# EAGLE design zumy_carrier_board (EAGLE 6.6.0)
AUTHOR: A.Pullin / A.J.Chen / A.D.Buchan; REVISION: F; YEAR: 2015
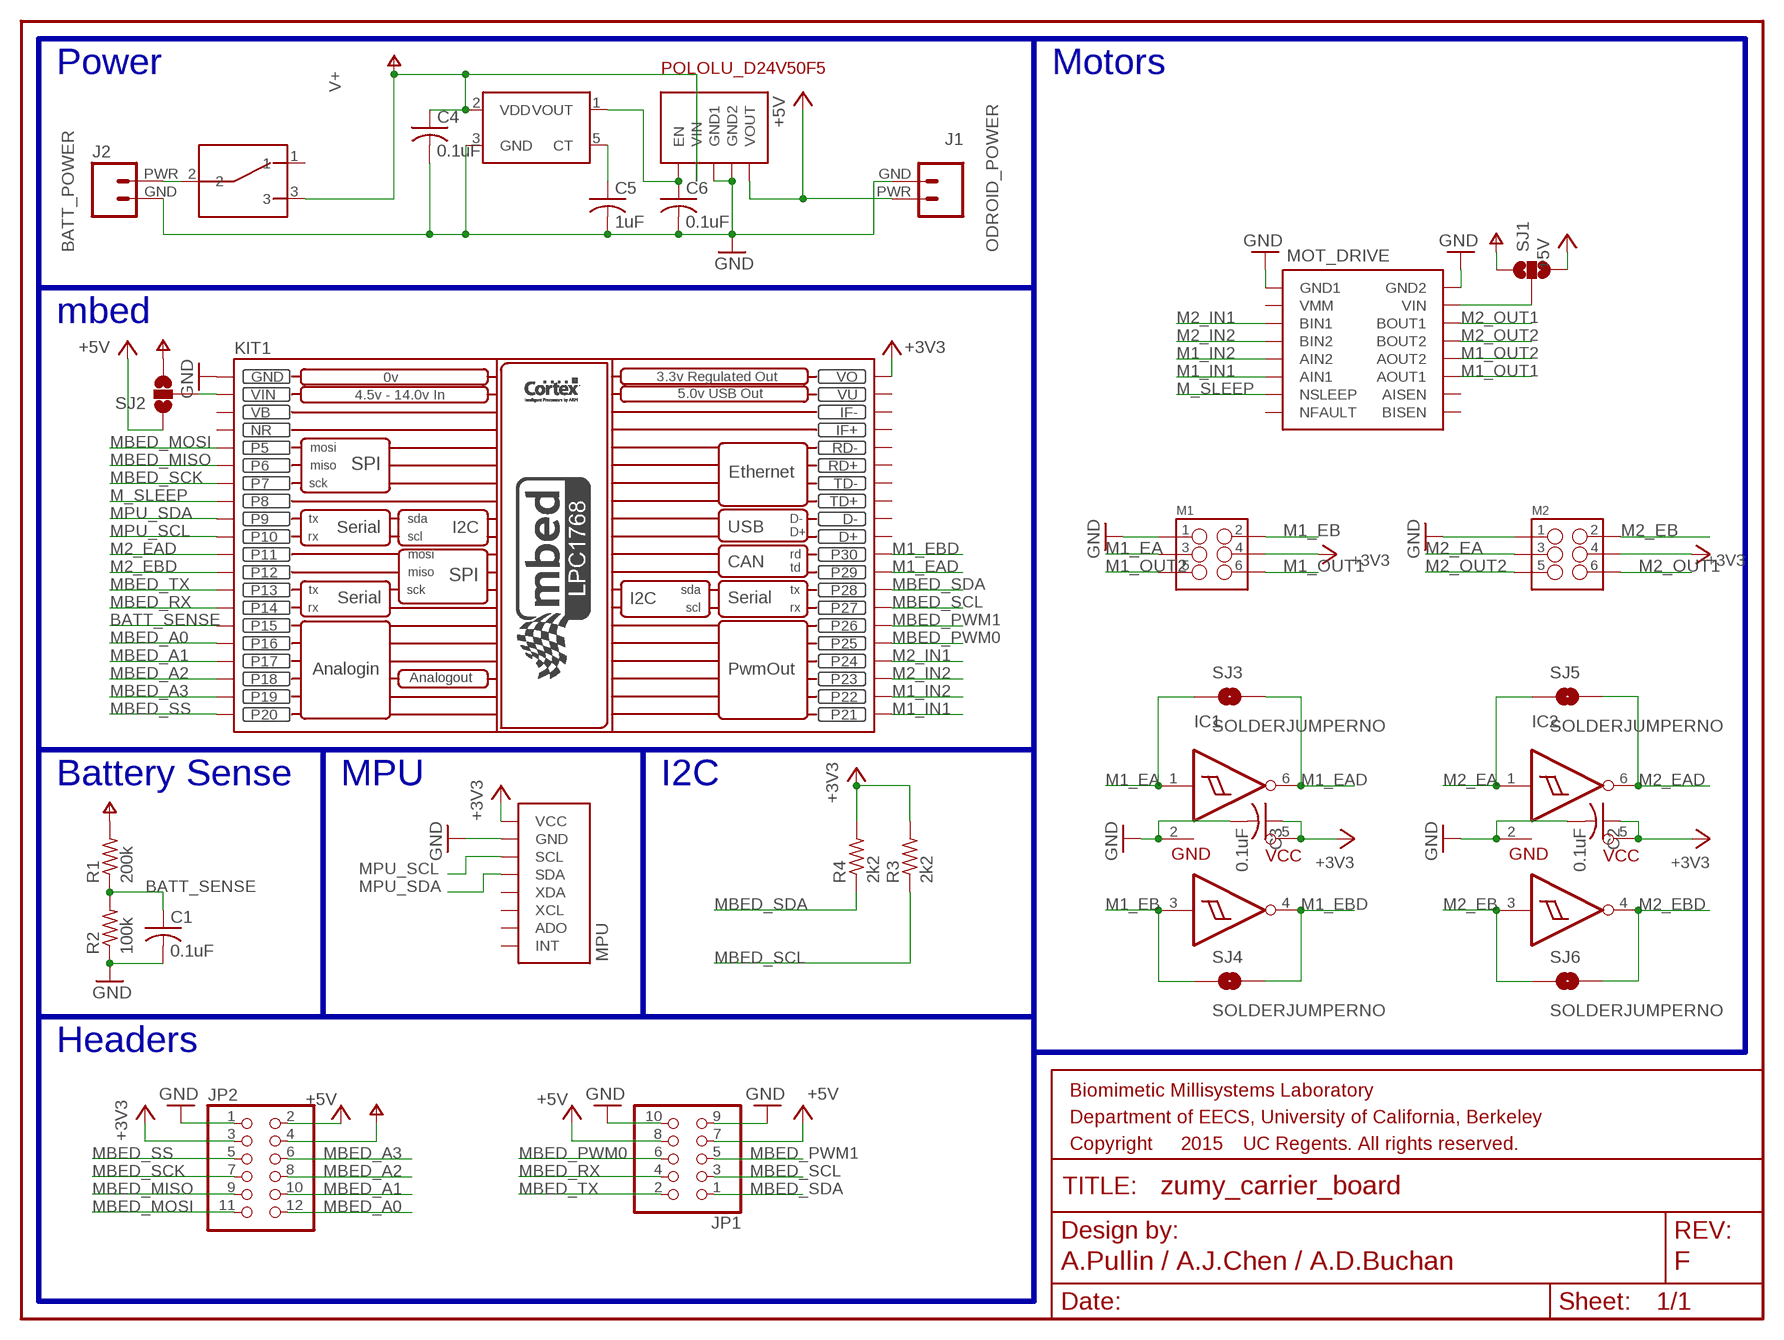
[diagram p0: schematic, sheet 1]

## Parts
C1  0.1uF  C-USC1206  [C1206]
C2  0.1uF  C-USC1206  [C1206]
C3  0.1uF  C-USC1206  [C1206]
C4  0.1uF  C-USC1206  [C1206]
C5  1uF  C-USC1206  [C1206]
C6  0.1uF  C-USC1206  [C1206]
IC1  SN74AUP2G17  [SC-70-6]
IC2  SN74AUP2G17  [SC-70-6]
J1  ODROID_POWER  [ODOIRD_PWR]
J2  BATT_POWER  [BATT_POWER]
JP1  PINHD-2X5  [2X05]
JP2  PINHD-2X6  [2X06]
KIT1  MBED_NXP_LPC1768  [MBED-KIT]
M1  M03X2SHROUD  [2X3-SHROUDED]
M2  M03X2SHROUD  [2X3-SHROUDED]
MOT_DRIVE  POLOLU_DRV8833_MODULE  [POLOLU_DRV8833_MODULE]
MPU  ITG/MPU_MODULE  [ITG/MPU_MODULE]
R1  200k  R-US_R1206  [R1206]
R2  100k  R-US_R1206  [R1206]
R3  2k2  R-US_R1206  [R1206]
R4  2k2  R-US_R1206  [R1206]
SJ1  SOLDERJUMPER_2WAYT  [SJ_2]
SJ2  SOLDERJUMPER_2WAYT  [SJ_2]
SJ3  SOLDERJUMPERNO  [SJ_2S-NO]
SJ4  SOLDERJUMPERNO  [SJ_2S-NO]
SJ5  SOLDERJUMPERNO  [SJ_2S-NO]
SJ6  SOLDERJUMPERNO  [SJ_2S-NO]
SW1  500SSP1S1M6QEA  [500SSP1S1M6QEA_SWITCH]
U$2  BD5260G  [SOT23-5]
U$5  POLOLU_D24V50F5  [POLOLU_D24V50F5]

## Nets
+3V3: C2.1 C3.1 IC1.5(VCC) IC2.5(VCC) JP2.3 KIT1.VOUT(VO) M1.4 M2.4 MPU.VCC R3.2 R4.2
+5V: J1.PWR JP1.7 JP1.8 JP2.2 SJ1.3 SJ2.1 U$5.VOUT
BATT_SENSE: C1.1 KIT1.P$15(P15) R1.1 R2.2
GND: C1.2 C2.2 C3.2 C4.2 C5.2 C6.2 IC1.2(GND) IC2.2(GND) J1.GND J2.GND JP1.9 JP1.10 JP2.1 KIT1.GND M1.1 M2.1 MOT_DRIVE.GND1 MOT_DRIVE.GND2 MPU.GND R2.1 U$2.3(GND) U$5.GND1 U$5.GND2
M1_EA: IC1.1(1A) M1.3 SJ3.1
M1_EAD: IC1.6(1Y) KIT1.P$29(P29) SJ3.2
M1_EB: IC1.3(2A) M1.2 SJ4.1
M1_EBD: IC1.4(2Y) KIT1.P$30(P30) SJ4.2
M1_IN1: KIT1.P$21(P21) MOT_DRIVE.AIN1
M1_IN2: KIT1.P$22(P22) MOT_DRIVE.AIN2
M1_OUT1: M1.6 MOT_DRIVE.AOUT1
M1_OUT2: M1.5 MOT_DRIVE.AOUT2
M2_EA: IC2.1(1A) M2.3 SJ5.1
M2_EAD: IC2.6(1Y) KIT1.P$11(P11) SJ5.2
M2_EB: IC2.3(2A) M2.2 SJ6.1
M2_EBD: IC2.4(2Y) KIT1.P$12(P12) SJ6.2
M2_IN1: KIT1.P$24(P24) MOT_DRIVE.BIN1
M2_IN2: KIT1.P$23(P23) MOT_DRIVE.BIN2
M2_OUT1: M2.6 MOT_DRIVE.BOUT1
M2_OUT2: M2.5 MOT_DRIVE.BOUT2
M_SLEEP: KIT1.P$8(P8) MOT_DRIVE.NSLEEP
MBED_A0: JP2.12 KIT1.P$16(P16)
MBED_A1: JP2.10 KIT1.P$17(P17)
MBED_A2: JP2.8 KIT1.P$18(P18)
MBED_A3: JP2.6 KIT1.P$19(P19)
MBED_MISO: JP2.9 KIT1.P$6(P6)
MBED_MOSI: JP2.11 KIT1.P$5(P5)
MBED_PWM0: JP1.6 KIT1.P$25(P25)
MBED_PWM1: JP1.5 KIT1.P$26(P26)
MBED_RX: JP1.4 KIT1.P$14(P14)
MBED_SCK: JP2.7 KIT1.P$7(P7)
MBED_SCL: JP1.3 KIT1.P$27(P27) R3.1
MBED_SDA: JP1.1 KIT1.P$28(P28) R4.1
MBED_SS: JP2.5 KIT1.P$20(P20)
MBED_TX: JP1.2 KIT1.P$13(P13)
MPU_SCL: KIT1.P$10(P10) MPU.SCL
MPU_SDA: KIT1.P$9(P9) MPU.SDA
N$1: KIT1.VIN SJ2.2
N$2: J2.PWR SW1.2
N$3: MOT_DRIVE.VIN SJ1.2
N$4: C6.1 U$2.1(VOUT) U$5.EN
N$6: C5.1 U$2.5(CT)
V+: C4.1 JP2.4 R1.2 SJ1.1 SJ2.3 SW1.3 U$2.2(VDD) U$5.VIN
Unconnected: KIT1.D+ KIT1.D- KIT1.IF+ KIT1.IF- KIT1.RD+ KIT1.RD- KIT1.TD+ KIT1.TD- MOT_DRIVE.AISEN MOT_DRIVE.BISEN MOT_DRIVE.NFAULT MOT_DRIVE.VMM MPU.ADO MPU.INT MPU.XCL MPU.XDA SW1.1

## Buses
B$1

## Notes on the sheet
- Power | Motors
- mbed
- Battery Sense | MPU | I2C
- Headers

## Power pins joined to a net without a drawn wire
NR: KIT1.NR
VB: KIT1.VB
VU: KIT1.VU

## Library data of the parts
C1-C6 = rcl:C-US: CAPACITOR, American symbol
IC1 IC2 = zumy:SN74AUP2G17
J1 = zumy:ODROID_POWER
J2 = zumy:BATT_POWER
JP1 = pinhead:PINHD-2X5: PIN HEADER
JP2 = pinhead:PINHD-2X6: PIN HEADER
KIT1 = zumy:MBED_NXP_LPC1768: Mbed LPC1768 - ARM CORTEX v2.1 * Schematic symbol is now placed in eagles's default raster. *The pads diameter are suitable for routing between mbed pins * mbed pads are 0.8 mm drill diameter. --------------------------------------------- Created by: Mohamed Yousry *Alexandria, Egypt *Email: mohamed.yousry@ieeegoldegypt.org
M1 M2 = SparkFun-Connectors:M03X2: 2x3 .1" header. Shrouded, with keying- CONN-10681 SMT- CONN-11415 Pogo pins- HW-11044; PROD_ID: CONN-10681
MOT_DRIVE = zumy:POLOLU_DRV8833_MODULE
MPU = zumy:ITG/MPU_MODULE
R1-R4 = resistor:R-US_: RESISTOR, American symbol
SJ1 SJ2 = SparkFun-Passives:SOLDERJUMPER_2WAY: Solder Jumper 2 way solder jumper
SJ3-SJ6 = SparkFun-Passives:SOLDERJUMPER: Solder Jumper Standard SMD solder jumper. Used to automate production. Two varients : Normally Open and Normally Closed are the same, but have different paste layers. NC will have a large amount of paste and should jumper during reflow.
SW1 = zumy:500SSP1S1M6QEA
U$2 = zumy:BD5260G
U$5 = zumy:POLOLU_D24V50F5

## Board
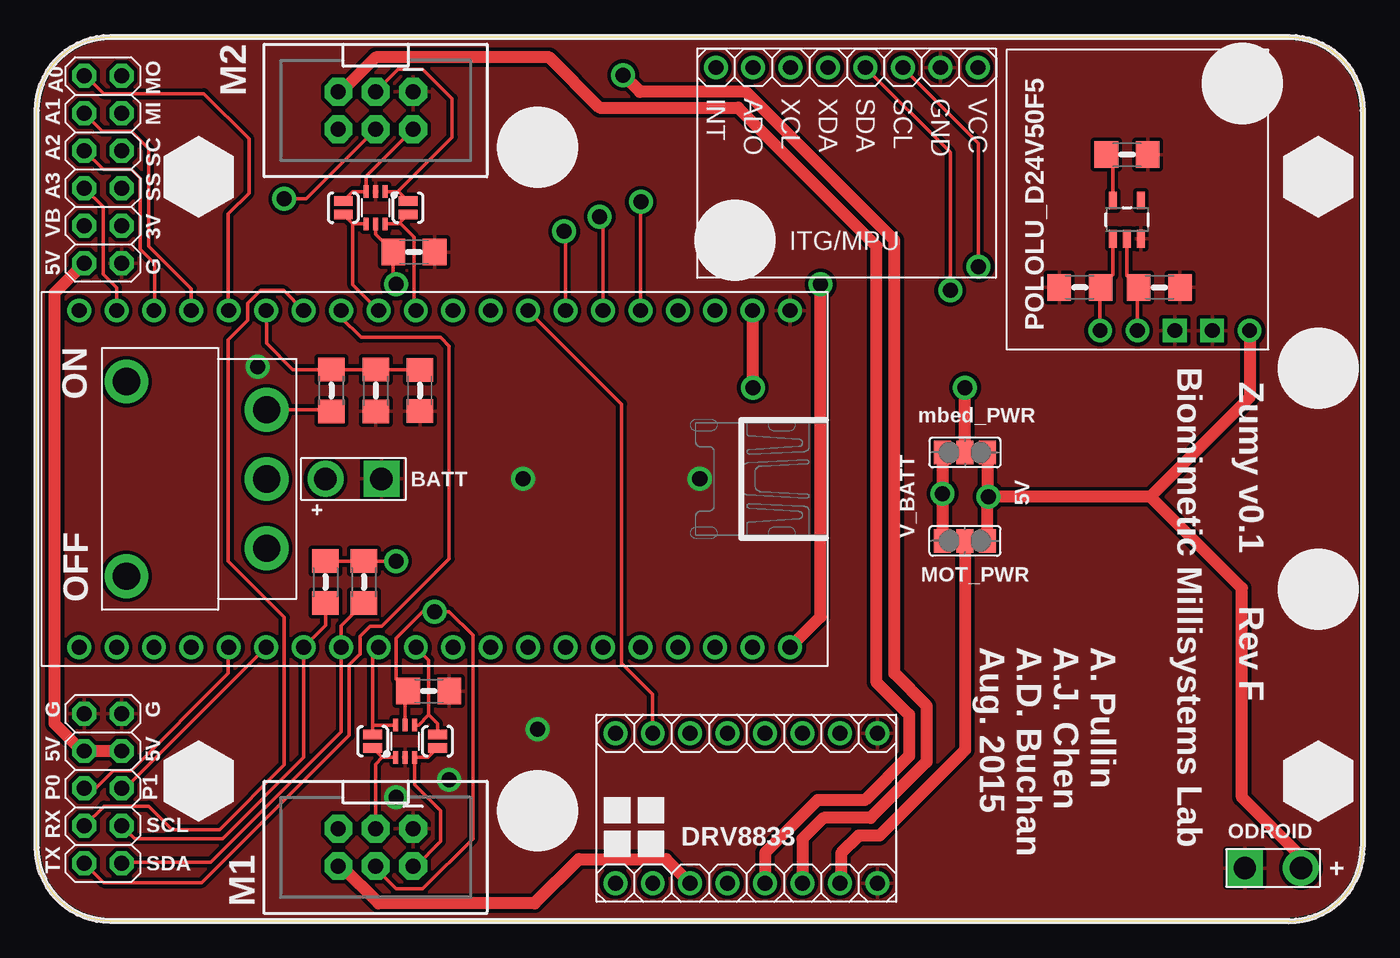
[diagram p1: board, top side]
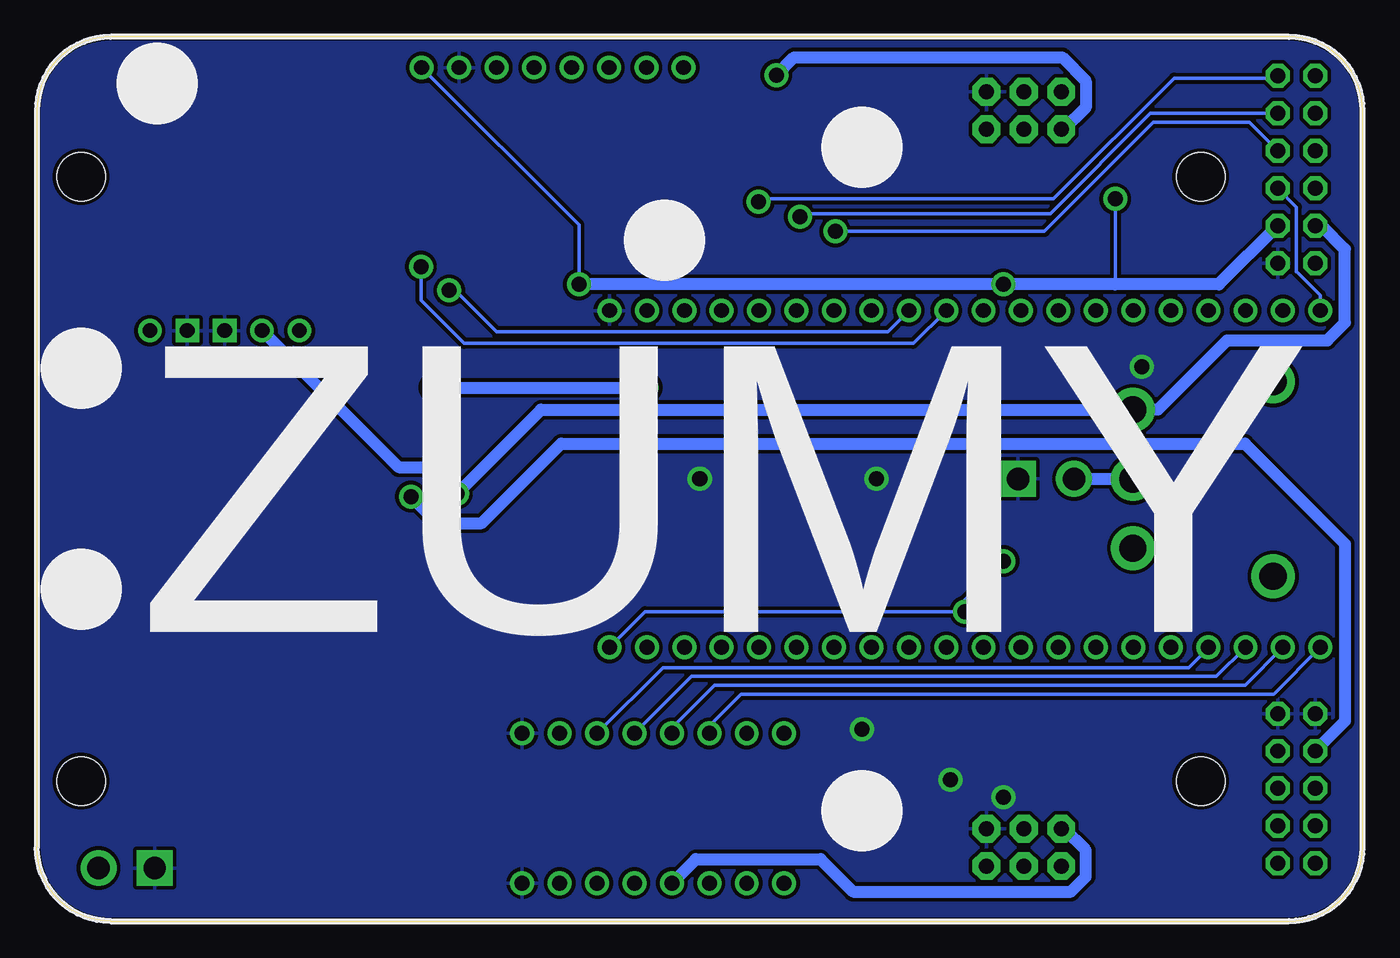
[diagram p2: board, bottom side, seen from below]

Size 90 x 60 mm. Coordinates in mm from the lower left corner, seen from the top.
Outline: 85,0 5,0 arc-90 0,5 0,55 arc-90 5,60 85,60 arc-90 90,55 90,5 arc-90 85,0
Copper layers (1*16): Top 2mil / dielectric 27mil / Bottom 2mil
Design rules "advancedcircuits-standard-biomimetic *": minimum track width 10mil, minimum drill 15mil, track to track 10mil, track to pad 10mil, pad to pad 10mil, via to via 10mil, smd to smd 10mil, copper to edge 5mil, drill to drill 15mil, minimum pad ring 10mil, minimum via ring 10mil, stop-mask expansion 6mil, vias tented up to drill 0mil, thermal gap 10mil

### Footprints (pad centres in the part's own frame; a part is rotated, then mirrored left to right if it is on the bottom)
C1206 = smd 1.6 x 1.8: 1 -1.4,0; 2 1.4,0
SC-70-6 = smd 0.35 x 0.85: 1 -0.65,-1.1; 2 0,-1.1; 3 0.65,-1.1; 4 0.65,1.1; 5 0,1.1; 6 -0.65,1.1
ODOIRD_PWR = drill 1.524 square: GND 0,0 | drill 1.524: PWR 3.81,0
BATT_POWER = drill 1.524 square: GND 0,0 | drill 1.524: PWR 3.81,0
2X05 = drill 1.016 octagon: 1 -5.08,-1.27; 2 -5.08,1.27; 3 -2.54,-1.27; 4 -2.54,1.27; 5 0,-1.27; 6 0,1.27; 7 2.54,-1.27; 8 2.54,1.27; 9 5.08,-1.27; 10 5.08,1.27
2X06 = drill 1.016 octagon: 1 -6.35,-1.27; 2 -6.35,1.27; 3 -3.81,-1.27; 4 -3.81,1.27; 5 -1.27,-1.27; 6 -1.27,1.27; 7 1.27,-1.27; 8 1.27,1.27; 9 3.81,-1.27; 10 3.81,1.27; 11 6.35,-1.27; 12 6.35,1.27
MBED-KIT = drill 1.016: D+ 11.43,1.27; D- 11.43,3.81; GND -11.43,24.13; IF+ 11.43,16.51; IF- 11.43,19.05; NR -11.43,16.51; P$5 -11.43,13.97; P$6 -11.43,11.43; P$7 -11.43,8.89; P$8 -11.43,6.35; P$9 -11.43,3.81; P$10 -11.43,1.27; P$11 -11.43,-1.27; P$12 -11.43,-3.81; P$13 -11.43,-6.35; P$14 -11.43,-8.89; P$15 -11.43,-11.43; P$16 -11.43,-13.97; P$17 -11.43,-16.51; P$18 -11.43,-19.05; P$19 -11.43,-21.59; P$20 -11.43,-24.13; P$21 11.43,-24.13; P$22 11.43,-21.59; P$23 11.43,-19.05; P$24 11.43,-16.51; P$25 11.43,-13.97; P$26 11.43,-11.43; P$27 11.43,-8.89; P$28 11.43,-6.35; P$29 11.43,-3.81; P$30 11.43,-1.27; RD+ 11.43,11.43; RD- 11.43,13.97; TD+ 11.43,6.35; TD- 11.43,8.89; VB -11.43,19.05; VIN -11.43,21.59; VOUT 11.43,24.13; VU 11.43,21.59
2X3-SHROUDED = drill 1.016 pad 1.88 octagon: 1 -1.27,2.54; 2 1.27,2.54; 3 -1.27,0; 4 1.27,0; 5 -1.27,-2.54; 6 1.27,-2.54
POLOLU_DRV8833_MODULE = drill 1.016: AIN1 1.27,6.35; AIN2 1.27,8.89; AISEN 11.43,3.81; AOUT1 11.43,6.35; AOUT2 11.43,8.89; BIN1 1.27,13.97; BIN2 1.27,11.43; BISEN 11.43,1.27; BOUT1 11.43,13.97; BOUT2 11.43,11.43; GND1 1.27,19.05; GND2 11.43,19.05; NFAULT 1.27,1.27; NSLEEP 1.27,3.81; VIN 11.43,16.51; VMM 1.27,16.51
ITG/MPU_MODULE = drill 1.016: ADO -6.372,7.919; GND 6.328,7.919; INT -8.912,7.919; SCL 3.788,7.919; SDA 1.248,7.919; VCC 8.868,7.919; XCL -3.832,7.919; XDA -1.292,7.919 | hole 2.4: -7.62,-3.81
R1206 = smd 1.6 x 1.803: 1 -1.422,0; 2 1.422,0
SJ_2 = smd 1.168 x 1.6: 1 -1.524,0; 2 0,0; 3 1.524,0
SJ_2S-NO = smd 0.635 x 1.27: 1 -0.45,0; 2 0.45,0
500SSP1S1M6QEA_SWITCH = drill 1.854: 1 -4.699,0; 2 0,0; 3 4.699,0; P$4 -6.604,9.525; P$5 6.604,9.525
CHASSIS_STANDOFF = hole 2.4: 0,0; 45,0; 15,53; 30,53
SOT23-5 = smd 0.55 x 1.2: 1 -0.95,-1.3; 2 0,-1.3; 3 0.95,-1.3; 4 0.95,1.3; 5 -0.95,1.3
STANDOFF_POSITION = hole 3.3: 0,0; 0,76; 41,0; 41,76
POLOLU_D24V50F5 = drill 1: EN 1.27,11.43; VIN 1.27,8.89; VOUT 1.27,1.27 | drill 1 square: GND1 1.27,6.35; GND2 1.27,3.81 | hole 2.4: 18.034,1.778

### Placement (x,y rotation side)
C1  26,36 270 top
C2  25.6,45.4 0 top
C3  26.6,15.6 0 top
C4  76.2,43 0 top
C5  74,52 0 top
C6  70.8,43 180 top
IC1  25,12.2 0 top
IC2  23,48.4 180 top
J1  82,3.6 0 top
J2  23.4,30 180 top
JP1  4.5,9 90 top
JP2  4.5,51 90 top
KIT1  27,30 270 top
M1  23,5 270 top
M2  23,55 270 top
MOT_DRIVE  38,14 270 top
MPU  55,50 0 top
R1  20,36 270 top
R2  23,36 90 top
R3  19.6,23 90 top
R4  22.2,23 90 top
SJ1  63,25.8 0 top
SJ2  63,31.8 180 top
SJ3  22.8,12.2 90 top
SJ4  27.2,12.2 90 top
SJ5  25.2,48.4 270 top
SJ6  20.8,48.4 270 top
SW1  15.6,30 90 top
U$1  [CHASSIS_STANDOFF]  34,52.5 270 top
U$2  74,47.6 0 top
U$4  [STANDOFF_POSITION]  87,9.5 90 top
U$5  83.6,38.8 90 top

### Tracks (layer width: path | path; a pad name or v marks a point on that pad's centre or on a via)
+3V3  (via drill 1.02)
  Top 0.254: R3.2 R4.2 v24.38,24.42 | IC1.5 25,15.4 C3.1 24.4,16.4 24.4,19.2 26.2,21 v27,21 28,21 29.6,19.4 29.6,5.6 26.2,2.2 24.4,2.2 23,3.6 M1.4 | IC2.5 23,46.6 C2.1 24.2,43.4 v24.4,43.2 | M2.4 18.27,49 v16.8,49
  Top 0.813: KIT1.VOUT 53.2,20.64 v53.2,43.2
  Bottom 0.254: KIT1.VOUT 48.7,21 v27,21 27,21.8 v24.38,24.42 | MPU.VCC 53.2,47.25 v53.2,43.2 | v16.8,49 16.8,43.2
  Bottom 0.813: JP2.3 9.76,43.2 16.8,43.2 v24.4,43.2 v53.2,43.2
+5V  (via drill 1.02)
  Top 0.813: JP2.2 1.2,42.62 1.2,13.4 3.06,11.54 JP1.8 JP1.7 | SJ2.1 64.52,28.88 v64.6,28.8 | 75.6,28.8 v64.6,28.8 | U$5.VOUT 82.33,35.53 75.6,28.8 | J1.PWR 85.81,4.39 81.8,8.4 81.8,22.6 75.6,28.8 | SJ1.3 64.52,28.72 v64.6,28.8
  Bottom 0.813: v64.6,28.8 62.8,27 59.8,27 54.4,32.4 8,32.4 1.2,25.6 1.2,13.57 JP1.8
BATT_SENSE
  Top 0.254: C1.1 25.98,37.42 R2.2 R1.1 17.38,37.42 15.6,39.2 15.6,41.4 KIT1.P$15
GND  (via drill 1.02)
  other vias: 24.4,8.4 28,9.6 33,30 45,30 15,37.6 34,13
  pour Bottom (isolate 0.254): 0,5 0,55 arc-90 5,60 85,60 arc-90 90,55 90,5 arc-90 85,0 5,0 arc-90
  pour Top (isolate 0.254): 90,5 90,55 arc90 85,60 5,60 arc90 0,55 0,5 arc90 5,0 85,0 arc90
M1_EA
  Top 0.254: IC1.1 23.45,11.1 | 23.45,11.1 SJ3.1 | M1.3 23,10.65 23.45,11.1
M1_EAD
  Top 0.254: SJ3.2 22.8,13.2 | 22.8,13.2 22.8,18.18 KIT1.P$29 | IC1.6 22.9,13.3 22.8,13.2
M1_EB
  Top 0.254: SJ4.1 26.55,11.1 IC1.3 25.65,9.25 27.4,7.5 27.4,5.4 25.73,3.73 M1.2
M1_EBD
  Top 0.254: IC1.4 25.9,13.3 26.6,14 | 26.6,14 26.6,17.7 KIT1.P$30 | SJ4.2 27.2,13.4 26.6,14
M1_IN1
  Bottom 0.254: 44.35,13.05 MOT_DRIVE.AIN1 44.35,13.25 42.2,15.4 6.04,15.4 KIT1.P$21
M1_IN2
  Bottom 0.254: MOT_DRIVE.AIN2 46.89,13.11 44,16 7.98,16 KIT1.P$22
M1_OUT1
  Top 0.813: MOT_DRIVE.AOUT1 42.72,4.2 36.8,4.2 33.8,1.2 23.2,1.2 20.67,3.73 M1.6
M1_OUT2
  Bottom 0.813: MOT_DRIVE.AOUT2 45.26,4.2 36.8,4.2 34.6,2 19.8,2 18.8,3 18.8,4.8 20.27,6.27 M1.5
M2_EA
  Top 0.254: SJ5.1 24.55,49.5 | 24.55,49.5 IC2.1 | M2.3 24.53,57.8 26.2,57.8 28.2,55.8 28.2,53.2 24.55,49.55 24.55,49.5
M2_EAD
  Top 0.254: IC2.6 24.55,47.3 24.62,47.38 | 24.62,47.38 SJ5.2 | KIT1.P$11 25.6,41.56 25.6,46.4 24.62,47.38
M2_EB
  Top 0.254: M2.2 22.35,50.54 IC2.3 21.45,49.5 SJ6.1
M2_EBD
  Top 0.254: SJ6.2 21.45,47.3 | 21.45,47.3 IC2.4 | KIT1.P$12 21.45,43.17 21.45,47.3
M2_IN1
  Bottom 0.254: MOT_DRIVE.BIN1 47.5,17.2 11.8,17.2 10.49,18.51 KIT1.P$24
M2_IN2
  Bottom 0.254: MOT_DRIVE.BIN2 45.56,16.6 9.92,16.6 KIT1.P$23
M2_OUT1  (via drill 1.02)
  Top 0.813: v39.8,57.4 40.93,56.27 48.13,56.27 58.2,46.2 58.2,16.8 60.4,14.6 60.4,10.8 56.6,7 53.4,7 51.97,5.57 MOT_DRIVE.BOUT1
  Bottom 0.813: v39.8,57.4 38.6,58.6 20.4,58.6 18.8,57 18.8,55.2 20.27,53.73 M2.6
M2_OUT2
  Top 0.813: M2.5 20.67,56.27 23,58.6 34.8,58.6 38.2,55.2 47.6,55.2 57,45.8 57,16.2 59.2,14 59.2,11.2 56.2,8.2 53,8.2 49.43,4.63 MOT_DRIVE.BOUT2
M_SLEEP
  Top 0.254: MOT_DRIVE.NSLEEP 41.81,15.39 39.76,17.44 39.7,17.44 39.7,35.08 KIT1.P$8
MBED_A0
  Top 0.254: JP2.12 3.32,57.35 4.53,56.14 11.33,56.14 14.4,53.07 14.4,49.4 13,48 13,41.46 KIT1.P$16
MBED_A1
  Top 0.254: KIT1.P$17 10.49,42.91 7.6,45.8 7.6,52.4 6.4,53.6 4.44,53.6 JP2.10
MBED_A2
  Top 0.254: JP2.8 4.5,51 6.4,51 7,50.4 7,45.6 8,44.6 8,41.48 KIT1.P$18
MBED_A3
  Top 0.254: KIT1.P$19 5.41,42.99 4.52,43.88 4.49,43.88 4.49,48.47 JP2.6
MBED_MISO  (via drill 1.02)
  Top 0.254: KIT1.P$6 38.43,47.57 v38.2,47.8
  Bottom 0.254: v38.2,47.8 38,48 21.2,48 14.4,54.8 JP2.9
MBED_MOSI  (via drill 1.02)
  Top 0.254: KIT1.P$5 40.97,48.77 v41,48.8
  Bottom 0.254: v41,48.8 40.8,49 21,49 12.8,57.2 5.92,57.2 JP2.11
MBED_PWM0
  Top 0.254: JP1.6 4,9 5.2,10.2 6.4,10.2 13,16.8 13,18.54 KIT1.P$25
MBED_PWM1
  Top 0.254: JP1.5 6,9 KIT1.P$26
MBED_RX
  Top 0.254: JP1.4 4.57,7.8 7.6,7.8 9.2,6.2 12.4,6.2 16.8,10.6 16.8,20.6 13,24.4 13,39.46 14.31,40.77 14.31,41.91 15.2,42.8 16.74,42.8 KIT1.P$14
MBED_SCK  (via drill 1.02)
  Top 0.254: KIT1.P$7 35.89,46.71 v35.8,46.8
  Bottom 0.254: v35.8,46.8 21.6,46.8 14.2,54.2 7.7,54.2 JP2.7
MBED_SCL
  Top 0.254: JP1.3 6.63,5.6 12.6,5.6 18.11,11.11 KIT1.P$27 19.6,20.06 R3.1
MBED_SDA
  Top 0.254: JP1.1 5.85,4 11.8,4 20.65,12.85 KIT1.P$28 20.65,20.03 R4.1
MBED_SS
  Bottom 0.254: KIT1.P$20 2.87,42.47 4.46,44.06 4.49,44.06 4.49,48.45 JP2.5
MBED_TX
  Top 0.254: JP1.2 4.55,2.6 11.2,2.6 21.2,12.6 21.2,17.4 21.92,18.12 21.95,18.12 21.95,19.32 22.63,20 23.4,20 28,24.6 28,39 27.4,39.6 22,39.6 20.65,40.95 KIT1.P$13
MPU_SCL  (via drill 1.02)
  Top 0.254: v63.93,44.4 63.93,52.78 MPU.SCL
  Bottom 0.254: KIT1.P$10 30.5,39.2 61,39.2 63.93,42.13 v63.93,44.4
MPU_SDA  (via drill 1.02)
  Top 0.254: v62,42.8 62,52.17 MPU.SDA
  Bottom 0.254: 61.8,43 arc-90 v62,42.8 61.6,42.8 58.8,40 32.24,40 KIT1.P$9
N$1  (via drill 1.02)
  Top 0.813: SJ2.2 v63,36.2 | v48.6,36.2 KIT1.VIN
  Bottom 0.813: v63,36.2 v48.6,36.2
N$2
  Bottom 0.813: J2.PWR SW1.2
N$3
  Top 0.813: SJ1.2 63,11.6 57.2,5.8 55.8,5.8 54.6,4.6 54.6,2.66 MOT_DRIVE.VIN
N$4
  Top 0.254: U$5.EN 72.17,42.97 C6.1 73.05,43.85 U$2.1
N$6
  Top 0.254: U$2.5 73.05,51.55 C5.1
V+  (via drill 1.02)
  Top 0.254: R1.2 19.88,34.7 SW1.3 | U$5.VIN 74.71,42.91 C4.1 74,43.8 U$2.2
  Top 0.813: SJ2.3 v61.48,29 SJ1.1
  Bottom 0.813: JP2.4 2.79,47.19 1.2,45.6 1.2,40.6 2.4,39.4 9.2,39.4 13.9,34.7 SW1.3 55.78,34.7 v61.48,29 61.8,29 63.6,30.8 65.44,30.8 U$5.VIN

### Text on the board
tPlace: MO | A0 | MI | M2 | A1 | SC | A2 | SS | A3 | 3V | VB | G | 5V | Biomimetic Millisystems Lab | Zumy v0.1 | ON | mbed_PWR | BATT | 5V | + | OFF | V_BATT | MOT_PWR | Rev F | A. Pullin / A.J. Chen / A.D. Buchan / Aug. 2015 | G | G | 5V | 5V | P0 | P1 | ODROID | RX | SCL | TX | SDA | M1
bPlace: ZUMY